# EasyEDA schematic SCH_tenth-portenta-stack_2023-01-13.json
TITLE: 6th Portenta 4 HD Student Shield; REV: 1.6; Date: 2021-09-13; Sheet: 1/1; Drawn By: rocksetta; Company: Rocksetta
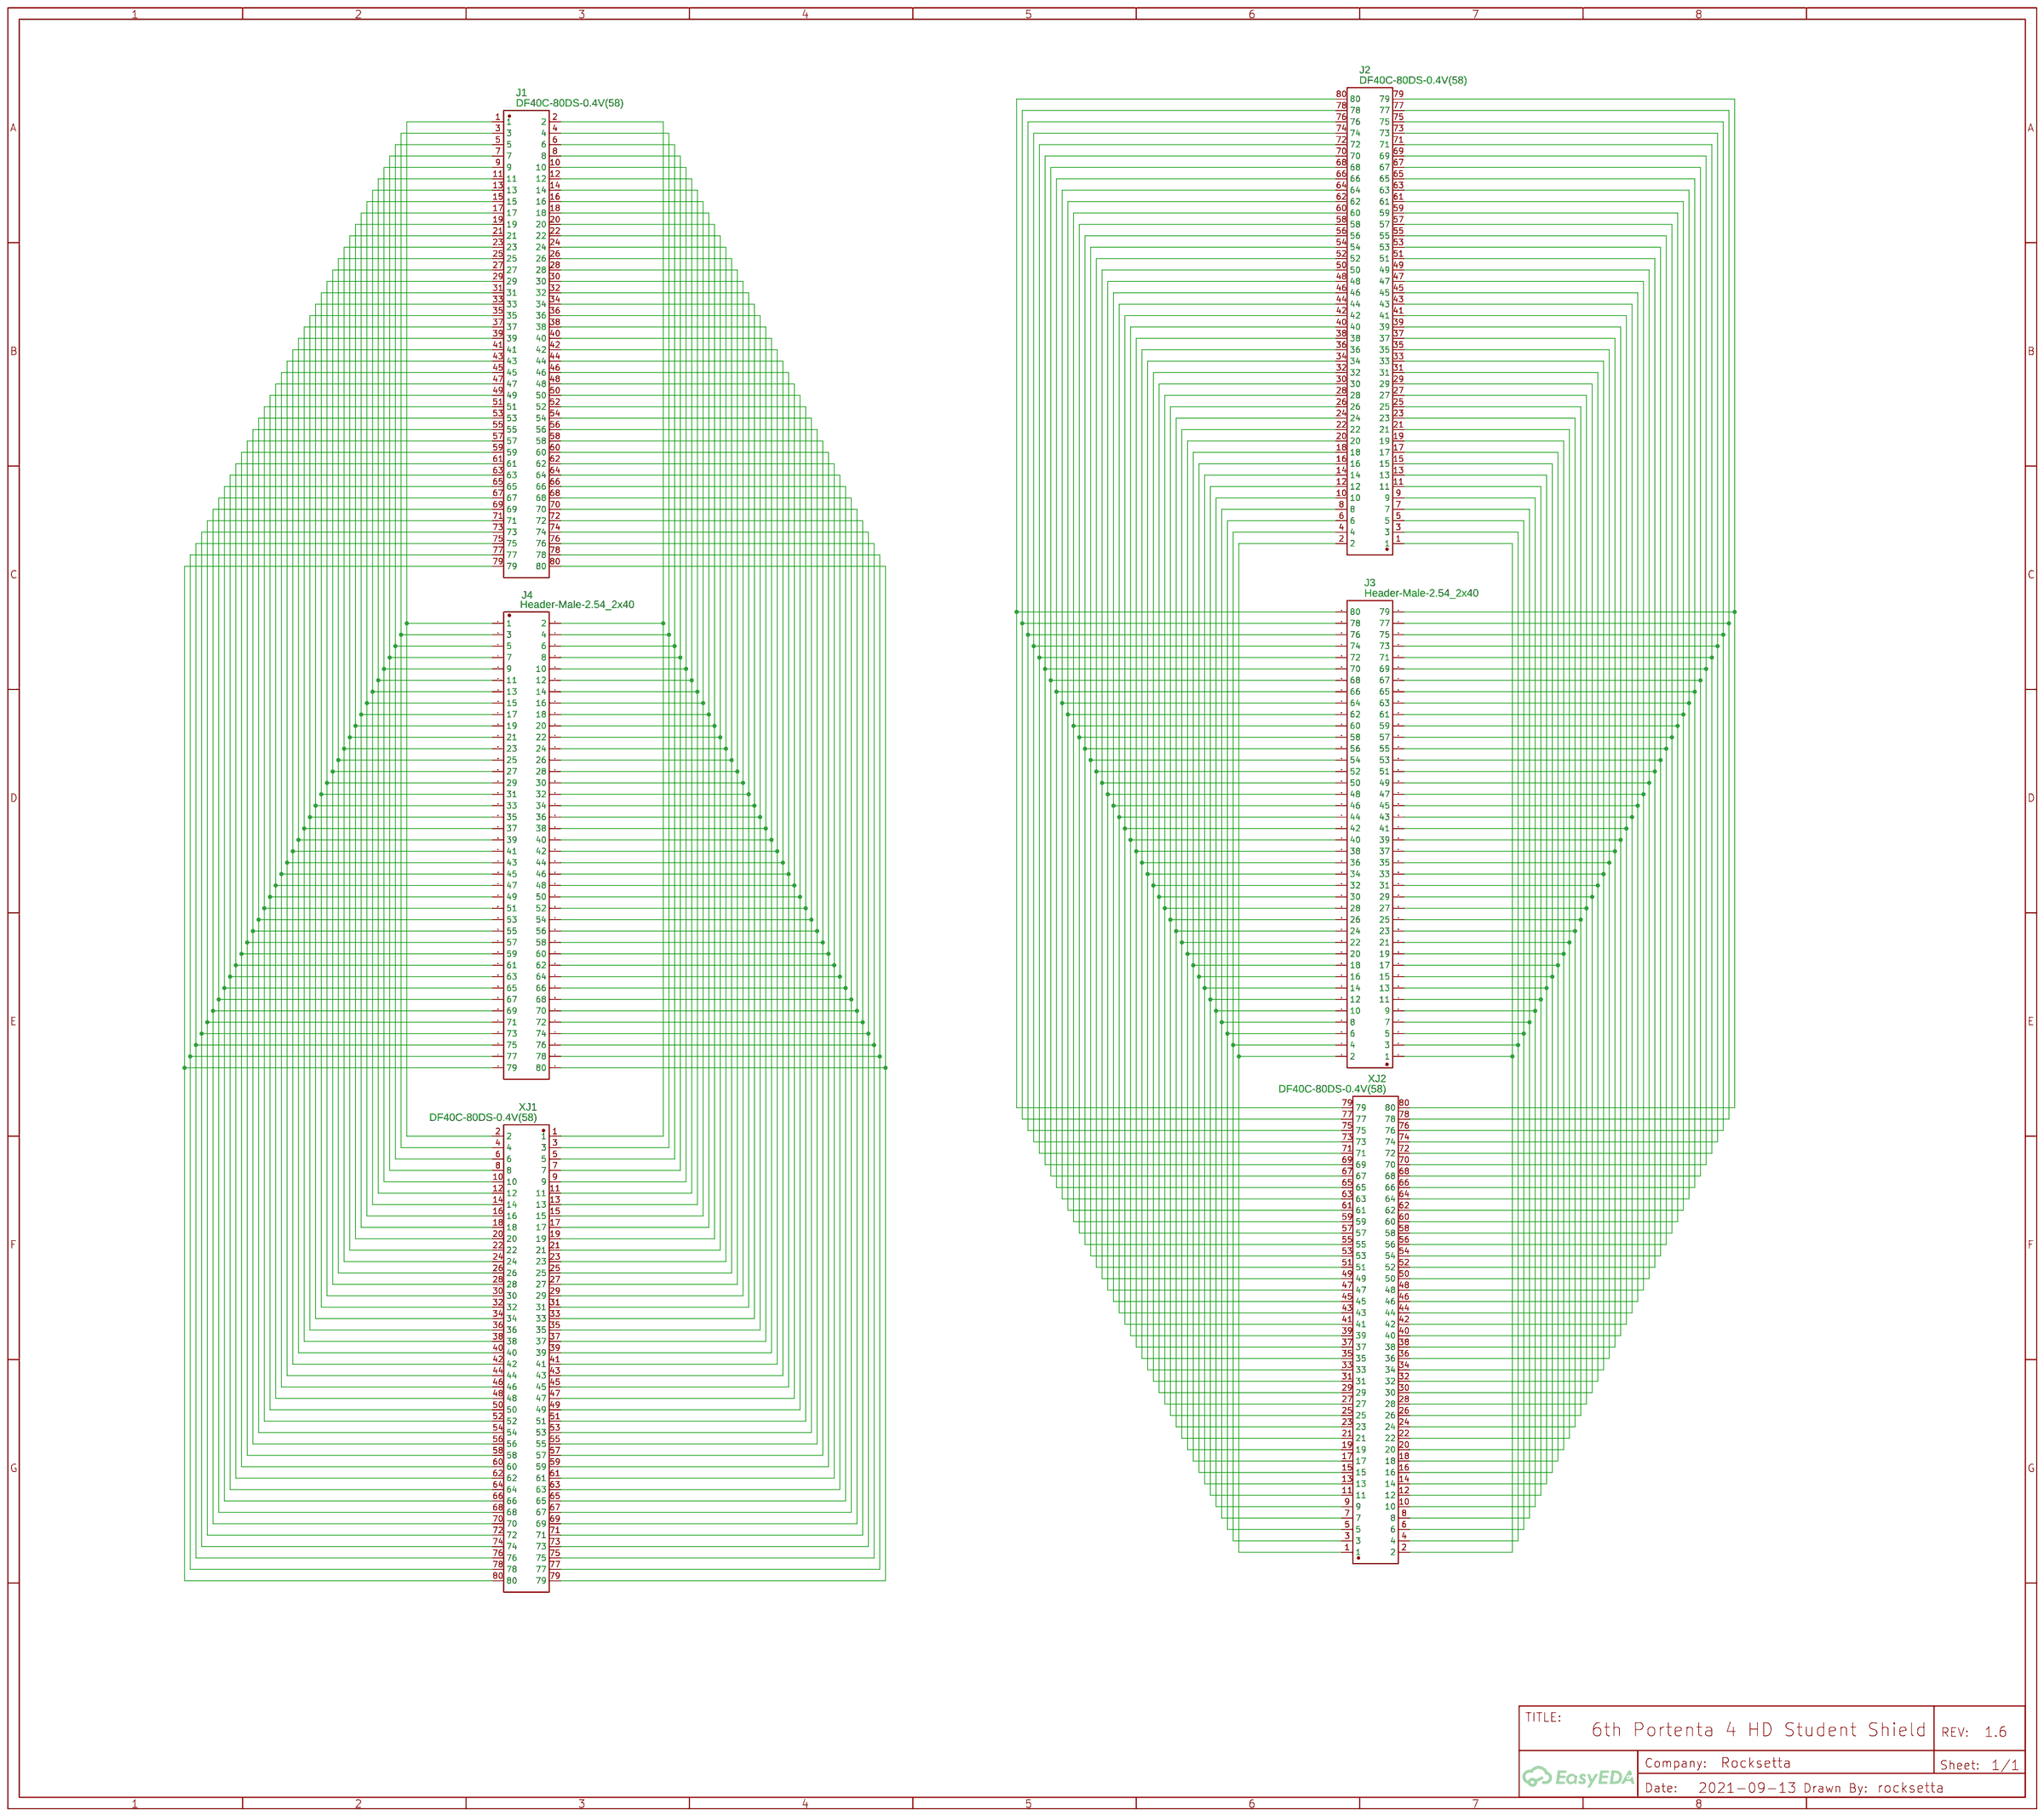
[diagram p0: schematic sheet]

## Parts
J1  DF40C-80DS-0.4V(58)  [CONN-SMD_DF40C-80DS-0.4V-58]
J2  DF40C-80DS-0.4V(58)  [CONN-SMD_DF40C-80DS-0.4V-58]
J3  Header-Male-2.54_2x40  [HDR-TH_80P-P2.54-V-M-R2-C40-S2.54]
J4  Header-Male-2.54_2x40  [HDR-TH_80P-P2.54-V-M-R2-C40-S2.54]
XJ1  DF40C-80DS-0.4V(58)  [CONN-SMD_DF40C-80DS-0.4V-58]
XJ2  DF40C-80DS-0.4V(58)  [CONN-SMD_DF40C-80DS-0.4V-58]

## Library data of the parts
J1 J2 XJ1 XJ2 = DF40C-80DS-0.4V(58): Supplier: LCSC; Supplier Part: C597941; Manufacturer: HRS(Hirose); Contributor: JLCPCB_Official; link: http://www.farnell.com/datasheets/2691051.pdf
J3 J4 = Header-Male-2.54_2x40: Supplier: LCSC; Manufacturer: BOOMELE; Manufacturer Part: 2.54mm 2x40P; Supplier Part: C2333; JLCPCB Part Class: Extended Part

## Nets
Net-(J1-1): J1.1 J4.1 XJ1.2
Net-(J1-2): J1.2 J4.2 XJ1.1
Net-(J1-3): J1.3 J4.3 XJ1.4
Net-(J1-4): J1.4 J4.4 XJ1.3
Net-(J1-5): J1.5 J4.5 XJ1.6
Net-(J1-6): J1.6 J4.6 XJ1.5
Net-(J1-7): J1.7 J4.7 XJ1.8
Net-(J1-8): J1.8 J4.8 XJ1.7
Net-(J1-9): J1.9 J4.9 XJ1.10
Net-(J1-10): J1.10 J4.10 XJ1.9
Net-(J1-11): J1.11 J4.11 XJ1.12
Net-(J1-12): J1.12 J4.12 XJ1.11
Net-(J1-13): J1.13 J4.13 XJ1.14
Net-(J1-14): J1.14 J4.14 XJ1.13
Net-(J1-15): J1.15 J4.15 XJ1.16
Net-(J1-16): J1.16 J4.16 XJ1.15
Net-(J1-17): J1.17 J4.17 XJ1.18
Net-(J1-18): J1.18 J4.18 XJ1.17
Net-(J1-19): J1.19 J4.19 XJ1.20
Net-(J1-20): J1.20 J4.20 XJ1.19
Net-(J1-21): J1.21 J4.21 XJ1.22
Net-(J1-22): J1.22 J4.22 XJ1.21
Net-(J1-23): J1.23 J4.23 XJ1.24
Net-(J1-24): J1.24 J4.24 XJ1.23
Net-(J1-25): J1.25 J4.25 XJ1.26
Net-(J1-26): J1.26 J4.26 XJ1.25
Net-(J1-27): J1.27 J4.27 XJ1.28
Net-(J1-28): J1.28 J4.28 XJ1.27
Net-(J1-29): J1.29 J4.29 XJ1.30
Net-(J1-30): J1.30 J4.30 XJ1.29
Net-(J1-31): J1.31 J4.31 XJ1.32
Net-(J1-32): J1.32 J4.32 XJ1.31
Net-(J1-33): J1.33 J4.33 XJ1.34
Net-(J1-34): J1.34 J4.34 XJ1.33
Net-(J1-35): J1.35 J4.35 XJ1.36
Net-(J1-36): J1.36 J4.36 XJ1.35
Net-(J1-37): J1.37 J4.37 XJ1.38
Net-(J1-38): J1.38 J4.38 XJ1.37
Net-(J1-39): J1.39 J4.39 XJ1.40
Net-(J1-40): J1.40 J4.40 XJ1.39
Net-(J1-41): J1.41 J4.41 XJ1.42
Net-(J1-42): J1.42 J4.42 XJ1.41
Net-(J1-43): J1.43 J4.43 XJ1.44
Net-(J1-44): J1.44 J4.44 XJ1.43
Net-(J1-45): J1.45 J4.45 XJ1.46
Net-(J1-46): J1.46 J4.46 XJ1.45
Net-(J1-47): J1.47 J4.47 XJ1.48
Net-(J1-48): J1.48 J4.48 XJ1.47
Net-(J1-49): J1.49 J4.49 XJ1.50
Net-(J1-50): J1.50 J4.50 XJ1.49
Net-(J1-51): J1.51 J4.51 XJ1.52
Net-(J1-52): J1.52 J4.52 XJ1.51
Net-(J1-53): J1.53 J4.53 XJ1.54
Net-(J1-54): J1.54 J4.54 XJ1.53
Net-(J1-55): J1.55 J4.55 XJ1.56
Net-(J1-56): J1.56 J4.56 XJ1.55
Net-(J1-57): J1.57 J4.57 XJ1.58
Net-(J1-58): J1.58 J4.58 XJ1.57
Net-(J1-59): J1.59 J4.59 XJ1.60
Net-(J1-60): J1.60 J4.60 XJ1.59
Net-(J1-61): J1.61 J4.61 XJ1.62
Net-(J1-62): J1.62 J4.62 XJ1.61
Net-(J1-63): J1.63 J4.63 XJ1.64
Net-(J1-64): J1.64 J4.64 XJ1.63
Net-(J1-65): J1.65 J4.65 XJ1.66
Net-(J1-66): J1.66 J4.66 XJ1.65
Net-(J1-67): J1.67 J4.67 XJ1.68
Net-(J1-68): J1.68 J4.68 XJ1.67
Net-(J1-69): J1.69 J4.69 XJ1.70
Net-(J1-70): J1.70 J4.70 XJ1.69
Net-(J1-71): J1.71 J4.71 XJ1.72
Net-(J1-72): J1.72 J4.72 XJ1.71
Net-(J1-73): J1.73 J4.73 XJ1.74
Net-(J1-74): J1.74 J4.74 XJ1.73
Net-(J1-75): J1.75 J4.75 XJ1.76
Net-(J1-76): J1.76 J4.76 XJ1.75
Net-(J1-77): J1.77 J4.77 XJ1.78
Net-(J1-78): J1.78 J4.78 XJ1.77
Net-(J1-79): J1.79 J4.79 XJ1.80
Net-(J1-80): J1.80 J4.80 XJ1.79
Net-(J2-1): J2.1 J3.1 XJ2.2
Net-(J2-2): J2.2 J3.2 XJ2.1
Net-(J2-3): J2.3 J3.3 XJ2.4
Net-(J2-4): J2.4 J3.4 XJ2.3
Net-(J2-5): J2.5 J3.5 XJ2.6
Net-(J2-6): J2.6 J3.6 XJ2.5
Net-(J2-7): J2.7 J3.7 XJ2.8
Net-(J2-8): J2.8 J3.8 XJ2.7
Net-(J2-9): J2.9 J3.9 XJ2.10
Net-(J2-10): J2.10 J3.10 XJ2.9
Net-(J2-11): J2.11 J3.11 XJ2.12
Net-(J2-12): J2.12 J3.12 XJ2.11
Net-(J2-13): J2.13 J3.13 XJ2.14
Net-(J2-14): J2.14 J3.14 XJ2.13
Net-(J2-15): J2.15 J3.15 XJ2.16
Net-(J2-16): J2.16 J3.16 XJ2.15
Net-(J2-17): J2.17 J3.17 XJ2.18
Net-(J2-18): J2.18 J3.18 XJ2.17
Net-(J2-19): J2.19 J3.19 XJ2.20
Net-(J2-20): J2.20 J3.20 XJ2.19
Net-(J2-21): J2.21 J3.21 XJ2.22
Net-(J2-22): J2.22 J3.22 XJ2.21
Net-(J2-23): J2.23 J3.23 XJ2.24
Net-(J2-24): J2.24 J3.24 XJ2.23
Net-(J2-25): J2.25 J3.25 XJ2.26
Net-(J2-26): J2.26 J3.26 XJ2.25
Net-(J2-27): J2.27 J3.27 XJ2.28
Net-(J2-28): J2.28 J3.28 XJ2.27
Net-(J2-29): J2.29 J3.29 XJ2.30
Net-(J2-30): J2.30 J3.30 XJ2.29
Net-(J2-31): J2.31 J3.31 XJ2.32
Net-(J2-32): J2.32 J3.32 XJ2.31
Net-(J2-33): J2.33 J3.33 XJ2.34
Net-(J2-34): J2.34 J3.34 XJ2.33
Net-(J2-35): J2.35 J3.35 XJ2.36
Net-(J2-36): J2.36 J3.36 XJ2.35
Net-(J2-37): J2.37 J3.37 XJ2.38
Net-(J2-38): J2.38 J3.38 XJ2.37
Net-(J2-39): J2.39 J3.39 XJ2.40
Net-(J2-40): J2.40 J3.40 XJ2.39
Net-(J2-41): J2.41 J3.41 XJ2.42
Net-(J2-42): J2.42 J3.42 XJ2.41
Net-(J2-43): J2.43 J3.43 XJ2.44
Net-(J2-44): J2.44 J3.44 XJ2.43
Net-(J2-45): J2.45 J3.45 XJ2.46
Net-(J2-46): J2.46 J3.46 XJ2.45
Net-(J2-47): J2.47 J3.47 XJ2.48
Net-(J2-48): J2.48 J3.48 XJ2.47
Net-(J2-49): J2.49 J3.49 XJ2.50
Net-(J2-50): J2.50 J3.50 XJ2.49
Net-(J2-51): J2.51 J3.51 XJ2.52
Net-(J2-52): J2.52 J3.52 XJ2.51
Net-(J2-53): J2.53 J3.53 XJ2.54
Net-(J2-54): J2.54 J3.54 XJ2.53
Net-(J2-55): J2.55 J3.55 XJ2.56
Net-(J2-56): J2.56 J3.56 XJ2.55
Net-(J2-57): J2.57 J3.57 XJ2.58
Net-(J2-58): J2.58 J3.58 XJ2.57
Net-(J2-59): J2.59 J3.59 XJ2.60
Net-(J2-60): J2.60 J3.60 XJ2.59
Net-(J2-61): J2.61 J3.61 XJ2.62
Net-(J2-62): J2.62 J3.62 XJ2.61
Net-(J2-63): J2.63 J3.63 XJ2.64
Net-(J2-64): J2.64 J3.64 XJ2.63
Net-(J2-65): J2.65 J3.65 XJ2.66
Net-(J2-66): J2.66 J3.66 XJ2.65
Net-(J2-67): J2.67 J3.67 XJ2.68
Net-(J2-68): J2.68 J3.68 XJ2.67
Net-(J2-69): J2.69 J3.69 XJ2.70
Net-(J2-70): J2.70 J3.70 XJ2.69
Net-(J2-71): J2.71 J3.71 XJ2.72
Net-(J2-72): J2.72 J3.72 XJ2.71
Net-(J2-73): J2.73 J3.73 XJ2.74
Net-(J2-74): J2.74 J3.74 XJ2.73
Net-(J2-75): J2.75 J3.75 XJ2.76
Net-(J2-76): J2.76 J3.76 XJ2.75
Net-(J2-77): J2.77 J3.77 XJ2.78
Net-(J2-78): J2.78 J3.78 XJ2.77
Net-(J2-79): J2.79 J3.79 XJ2.80
Net-(J2-80): J2.80 J3.80 XJ2.79
